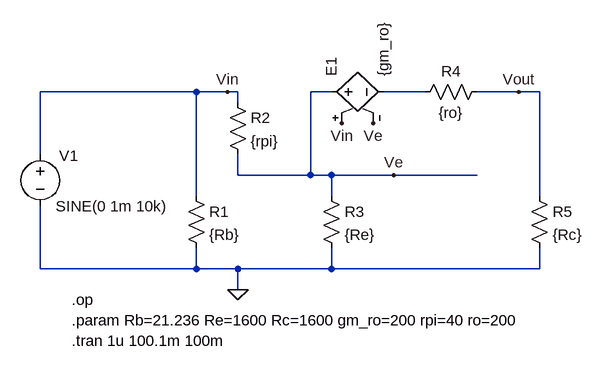
[diagram p0: schematic CE-degen-ro-gain-ac2.asc]
CE-degen-ro-gain-ac2.asc, the LTspice schematic file:
Version 4
SHEET 1 1048 680
WIRE 176 192 -64 192
WIRE 224 192 176 192
WIRE 240 192 224 192
WIRE 384 192 352 192
WIRE 528 192 464 192
WIRE 672 192 608 192
WIRE 704 192 672 192
WIRE 240 208 240 192
WIRE -64 288 -64 192
WIRE 240 320 240 288
WIRE 352 320 352 192
WIRE 352 320 240 320
WIRE 384 320 352 320
WIRE 480 320 384 320
WIRE 608 320 480 320
WIRE 176 352 176 192
WIRE 384 352 384 320
WIRE 704 352 704 192
WIRE -64 464 -64 368
WIRE 176 464 176 432
WIRE 176 464 -64 464
WIRE 240 464 176 464
WIRE 384 464 384 432
WIRE 384 464 240 464
WIRE 704 464 704 432
WIRE 704 464 384 464
WIRE 240 496 240 464
FLAG 240 496 0
FLAG 672 192 Vout
FLAG 480 320 Ve
FLAG 224 192 Vin
FLAG 400 240 Vin
FLAG 448 240 Ve
SYMBOL res 160 336 R0
SYMATTR InstName R1
SYMATTR Value {Rb}
SYMBOL res 224 192 R0
SYMATTR InstName R2
SYMATTR Value {rpi}
SYMBOL res 368 336 R0
SYMATTR InstName R3
SYMATTR Value {Re}
SYMBOL res 624 176 R90
WINDOW 0 0 56 VBottom 2
WINDOW 3 32 56 VTop 2
SYMATTR InstName R4
SYMATTR Value {ro}
SYMBOL res 688 336 R0
SYMATTR InstName R5
SYMATTR Value {Rc}
SYMBOL voltage -64 272 R0
WINDOW 0 29 18 Left 2
SYMATTR InstName V1
SYMATTR Value SINE(0 1m 10k)
SYMBOL e 368 192 R270
SYMATTR InstName E1
SYMATTR Value {gm_ro}
TEXT -16 512 Left 2 !.op\n.param Rb=21.236 Re=1600 Rc=1600 gm_ro=200 rpi=40 ro=200\n.tran 1u 100.1m 100m

The netlist it stands for:
* CE-degen-ro-gain-ac2.asc
R1 Vin 0 {Rb}
R2 Vin Ve {rpi}
R3 Ve 0 {Re}
R4 Vout N001 {ro}
R5 Vout 0 {Rc}
V1 Vin 0 SINE(0 1m 10k)
E1 Ve N001 Vin Ve {gm_ro}
.op
.param Rb=21.236 Re=1600 Rc=1600 gm_ro=200 rpi=40 ro=200
.tran 1u 100.1m 100m
.backanno
.end